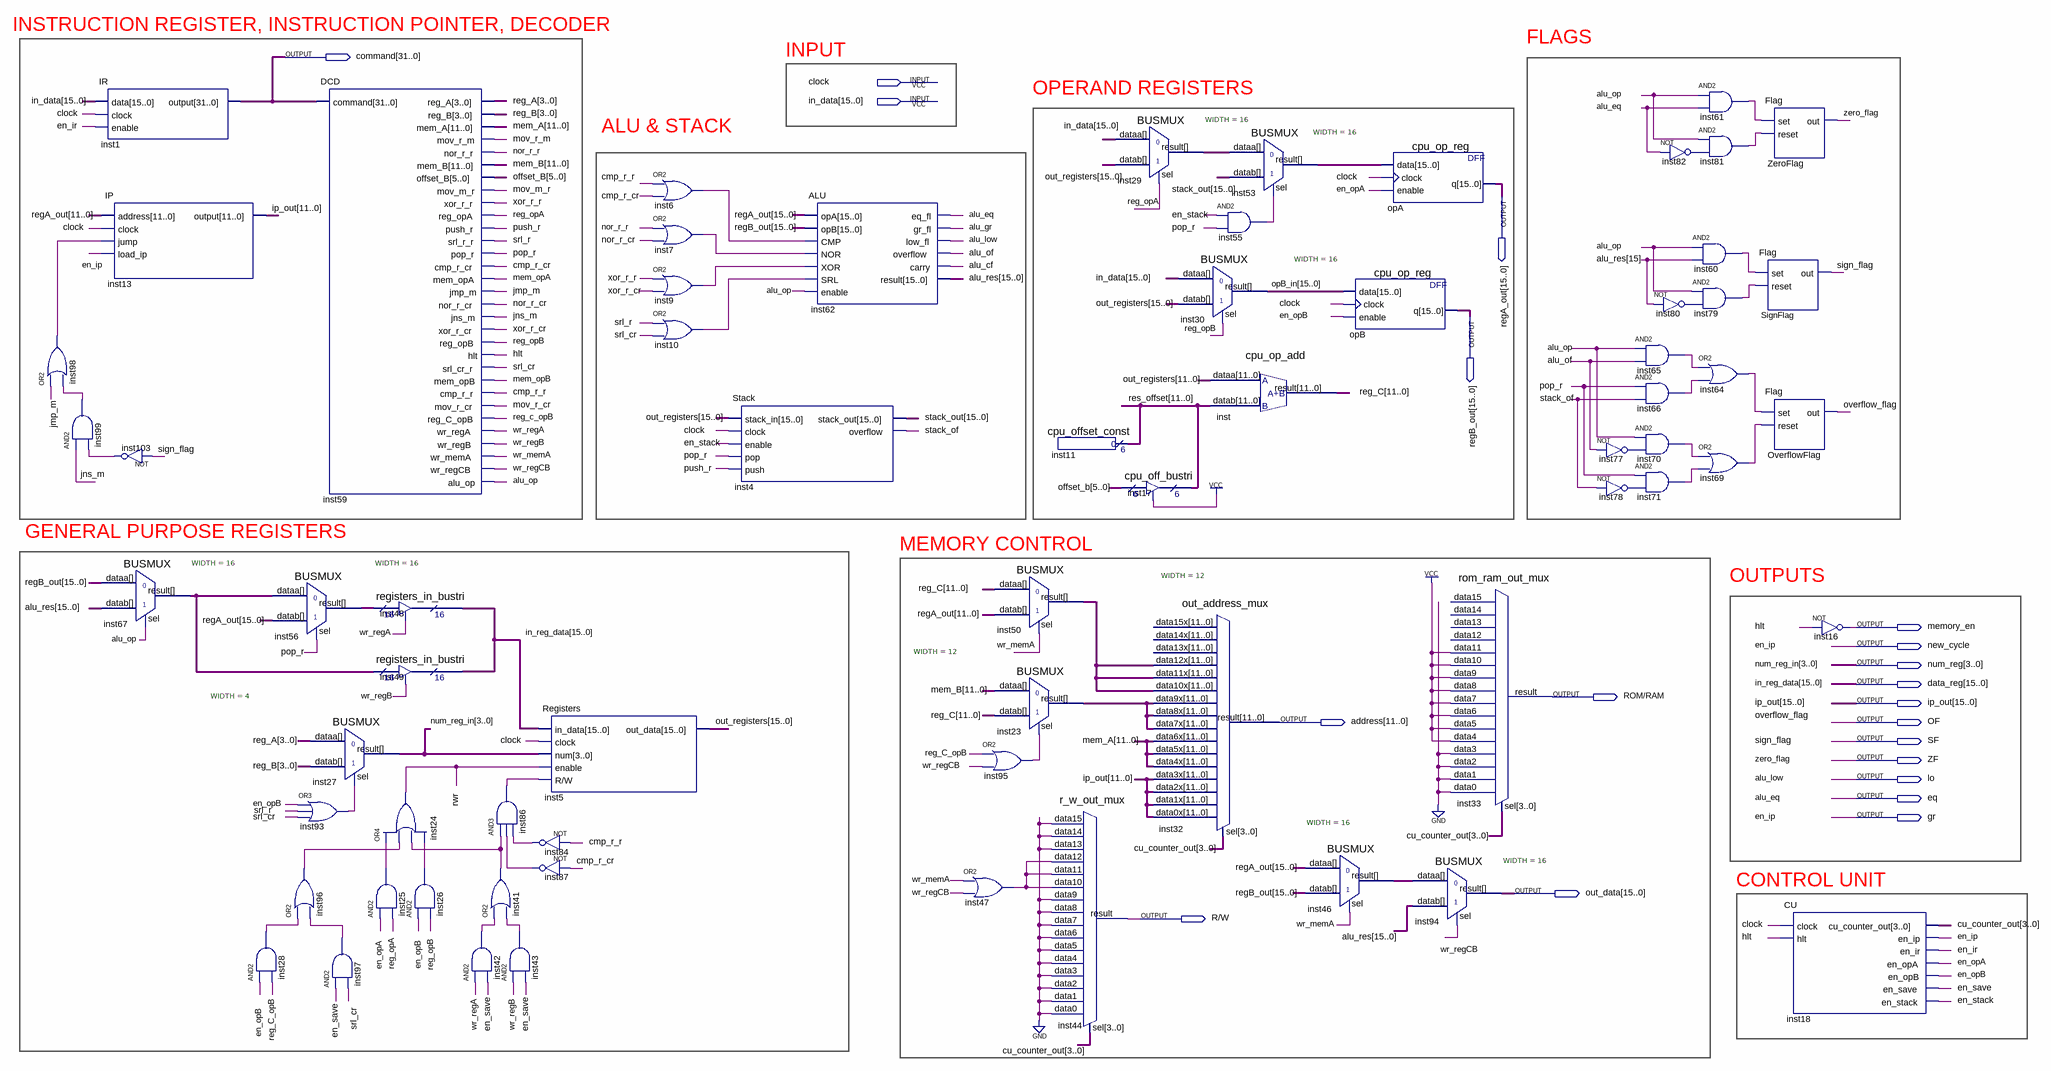
[diagram p0: schematic sheet]
// Quartus schematic CPU.bdf as structural Verilog: 68 symbols, 20 pins
module CPU (
  input  clock,
  input  [15:0] in_data,
  output [31:0] command,
  output [15:0] regA_out,
  output [15:0] regB_out,
  output memory_en,
  output new_cycle,
  output [3:0] num_reg,
  output [15:0] data_reg,
  output \ROM/RAM ,
  output [15:0] ip_out,
  output [11:0] address,
  output OF,
  output SF,
  output ZF,
  output lo,
  output eq,
  output gr,
  output [15:0] out_data,
  output \R/W 
);

  wire alu_cf, alu_gr, alu_of, alu_op, cmp_r_cr, cmp_r_r, en_ir, en_opA, en_opB, en_save, en_stack, hlt,
       inst6_out, inst7_out, inst9_out, inst10_out, inst25_out, inst26_out, inst28_out, inst41_out,
       inst42_out, inst43_out, inst47_out, inst55_out, inst60_out, inst61_out, inst64_out, inst65_out,
       inst66_out, inst69_out, inst70_out, inst71_out, inst77_out, inst78_out, inst79_out, inst80_out,
       inst81_out, inst82_out, inst84_out, inst86_out, inst87_out, inst93_out, inst95_out, inst96_out,
       inst97_out, inst98_out, inst99_out, inst103_out, jmp_m, jns_m, mem_opA, mem_opB, mov_m_r, mov_r_cr,
       mov_r_m, nor_r_cr, nor_r_r, pop_r, push_r, reg_C_opB, reg_opA, reg_opB, rwr, srl_cr, srl_r, stack_of,
       wr_memA, wr_regA, wr_regB, wr_regCB, xor_r_cr, xor_r_r;
  wire [3:0] cu_counter_out, reg_A, reg_B;
  wire [5:0] offset_B;
  wire [11:0] inst23_result, inst50_result, mem_A, mem_B, reg_C, res_offset;
  wire [15:0] alu_res, inst29_result, inst46_result, inst53_result, inst56_result, inst67_result, opB_in,
       out_registers, stack_out;

  or inst98 (inst98_out, jmp_m, inst99_out);
  IR inst1 (.data(in_data), .clock(clock), .enable(en_ir), .\output (command));
  IP inst13 (.address(regA_out[11:0]), .clock(clock), .jump(inst98_out), .load_ip(gr), .\output (ip_out[11:0]));
  and inst99 (inst99_out, jns_m, inst103_out);
  BUSMUX #(.WIDTH(16)) inst67 (.datab(alu_res), .sel(alu_op), .dataa(regB_out), .result(inst67_result));
  not inst103 (inst103_out, SF);
  and inst28 (inst28_out, en_opB, reg_C_opB);
  BUSMUX #(.WIDTH(16)) inst56 (.datab(regA_out), .sel(pop_r), .dataa(inst67_result), .result(inst56_result));
  BUSMUX #(.WIDTH(4)) inst27 (.datab(reg_B), .sel(inst93_out), .dataa(reg_A), .result(num_reg));
  or inst93 (inst93_out, en_opB, srl_r, srl_cr);
  or inst96 (inst96_out, inst28_out, inst97_out);
  DCD inst59 (
    .command(command), .reg_A(reg_A), .reg_B(reg_B), .mem_A(mem_A), .mov_r_m(mov_r_m), .nor_r_r(nor_r_r),
    .mem_B(mem_B), .offset_B(offset_B), .mov_m_r(mov_m_r), .xor_r_r(xor_r_r), .reg_opA(reg_opA),
    .push_r(push_r), .srl_r_r(srl_r), .pop_r(pop_r), .cmp_r_cr(cmp_r_cr), .mem_opA(mem_opA), .jmp_m(jmp_m),
    .nor_r_cr(nor_r_cr), .jns_m(jns_m), .xor_r_cr(xor_r_cr), .reg_opB(reg_opB), .hlt(hlt), .srl_cr_r(srl_cr),
    .mem_opB(mem_opB), .cmp_r_r(cmp_r_r), .mov_r_cr(mov_r_cr), .reg_C_opB(reg_C_opB), .wr_regA(wr_regA),
    .wr_regB(wr_regB), .wr_memA(wr_memA), .wr_regCB(wr_regCB), .alu_op(alu_op));
  and inst97 (inst97_out, en_save, srl_cr);
  registers_in_bustri inst48 (.enabledt(wr_regA), .data(inst56_result), .tridata(data_reg));
  registers_in_bustri inst49 (.enabledt(wr_regB), .data(inst67_result), .tridata(data_reg));
  or inst24 (rwr, inst25_out, inst96_out, inst41_out, inst26_out);
  and inst25 (inst25_out, en_opA, reg_opA);
  and inst26 (inst26_out, en_opB, reg_opB);
  and inst42 (inst42_out, wr_regA, en_save);
  and inst86 (inst86_out, inst41_out, inst87_out, inst84_out);
  or inst41 (inst41_out, inst42_out, inst43_out);
  and inst43 (inst43_out, wr_regB, en_save);
  Registers inst5 (
    .in_data(data_reg), .clock(clock), .num(num_reg), .enable(rwr), .\R/W (inst86_out),
    .out_data(out_registers));
  not inst84 (inst84_out, cmp_r_r);
  not inst87 (inst87_out, cmp_r_cr);
  or inst6 (inst6_out, cmp_r_r, cmp_r_cr);
  or inst7 (inst7_out, nor_r_r, nor_r_cr);
  or inst9 (inst9_out, xor_r_r, xor_r_cr);
  or inst10 (inst10_out, srl_r, srl_cr);
  Stack inst4 (
    .stack_in(out_registers), .clock(clock), .enable(en_stack), .pop(pop_r), .push(push_r),
    .stack_out(stack_out), .overflow(stack_of));
  ALU inst62 (
    .opA(regA_out), .opB(regB_out), .CMP(inst6_out), .NOR(inst7_out), .XOR(inst9_out), .SRL(inst10_out),
    .enable(alu_op), .eq_fl(eq), .gr_fl(alu_gr), .low_fl(lo), .overflow(alu_of), .carry(alu_cf),
    .result(alu_res));
  or inst47 (inst47_out, wr_memA, wr_regCB);
  BUSMUX #(.WIDTH(12)) inst50 (.datab(regA_out[11:0]), .sel(wr_memA), .dataa(reg_C), .result(inst50_result));
  BUSMUX #(.WIDTH(12)) inst23 (.datab(reg_C), .sel(inst95_out), .dataa(mem_B), .result(inst23_result));
  or inst95 (inst95_out, reg_C_opB, wr_regCB);
  cpu_offset_const inst11 (.result(res_offset[11:6]));
  r_w_out_mux inst44 (
    .data15(1'b0), .data14(1'b0), .data13(1'b0), .data12(inst47_out), .data11(inst47_out),
    .data10(inst47_out), .data9(1'b0), .data8(1'b0), .data7(1'b0), .data6(1'b0), .data5(1'b0), .data4(1'b0),
    .data3(1'b0), .data2(1'b0), .data1(1'b0), .data0(1'b0), .sel(cu_counter_out), .result(\R/W ));
  BUSMUX #(.WIDTH(16)) inst29 (.datab(out_registers), .sel(reg_opA), .dataa(in_data), .result(inst29_result));
  cpu_off_bustri inst17 (.enabledt(1'b1), .data(offset_B), .tridata(res_offset[5:0]));
  out_address_mux inst32 (
    .data12x(inst50_result), .data11x(inst50_result), .data10x(inst50_result), .data9x(inst23_result),
    .data8x(inst23_result), .data7x(inst23_result), .data6x(mem_A), .data5x(mem_A), .data4x(mem_A),
    .data3x(ip_out[11:0]), .data2x(ip_out[11:0]), .data1x(ip_out[11:0]), .data0x(ip_out[11:0]),
    .sel(cu_counter_out), .result(address));  // open: data15x, data14x, data13x
  and inst55 (inst55_out, en_stack, pop_r);
  BUSMUX #(.WIDTH(16)) inst30 (.datab(out_registers), .sel(reg_opB), .dataa(in_data), .result(opB_in));
  cpu_op_add inst (.dataa(out_registers[11:0]), .datab(res_offset), .result(reg_C));
  BUSMUX #(.WIDTH(16)) inst53 (.datab(stack_out), .sel(inst55_out), .dataa(inst29_result), .result(inst53_result));
  BUSMUX #(.WIDTH(16)) inst46 (.datab(regB_out), .sel(wr_memA), .dataa(regA_out), .result(inst46_result));
  cpu_op_reg opB (.data(opB_in), .clock(clock), .enable(en_opB), .q(regB_out));
  cpu_op_reg opA (.data(inst53_result), .clock(clock), .enable(en_opA), .q(regA_out));
  BUSMUX #(.WIDTH(16)) inst94 (.datab(alu_res), .sel(wr_regCB), .dataa(inst46_result), .result(out_data));
  rom_ram_out_mux inst33 (
    .data11(1'b1), .data10(1'b1), .data9(1'b1), .data8(1'b1), .data7(1'b1), .data6(1'b1), .data5(1'b1),
    .data4(1'b1), .data3(1'b0), .data2(1'b0), .data1(1'b0), .data0(1'b0), .sel(cu_counter_out),
    .result(\ROM/RAM ));  // open: data15, data14, data13, data12
  not inst77 (inst77_out, alu_of);
  not inst78 (inst78_out, stack_of);
  not inst82 (inst82_out, eq);
  not inst80 (inst80_out, alu_res[15]);
  and inst65 (inst65_out, alu_op, alu_of);
  and inst66 (inst66_out, pop_r, stack_of);
  and inst70 (inst70_out, alu_op, inst77_out);
  and inst71 (inst71_out, pop_r, inst78_out);
  and inst61 (inst61_out, alu_op, eq);
  and inst81 (inst81_out, alu_op, inst82_out);
  and inst60 (inst60_out, alu_op, alu_res[15]);
  and inst79 (inst79_out, alu_op, inst80_out);
  or inst64 (inst64_out, inst65_out, inst66_out);
  or inst69 (inst69_out, inst70_out, inst71_out);
  Flag ZeroFlag (.set(inst61_out), .reset(inst81_out), .out(ZF));
  Flag SignFlag (.set(inst60_out), .reset(inst79_out), .out(SF));
  Flag OverflowFlag (.set(inst64_out), .reset(inst69_out), .out(OF));
  CU inst18 (
    .clock(clock), .hlt(hlt), .cu_counter_out(cu_counter_out), .en_ip(gr), .en_ir(en_ir), .en_opA(en_opA),
    .en_opB(en_opB), .en_save(en_save), .en_stack(en_stack));
  not inst16 (memory_en, hlt);

  assign new_cycle = gr;

  // Other names for the same wires on the sheet: alu_eq = eq; alu_low = lo; en_ip = gr; in_reg_data[15:0] = data_reg;
  //   num_reg_in[3:0] = num_reg; overflow_flag = OF; sign_flag = SF; zero_flag = ZF

  // Notes on the sheet:
  //   INSTRUCTION REGISTER, INSTRUCTION POINTER, DECODER
  //   FLAGS
  //   INPUT
  //   OPERAND REGISTERS
  //   ALU & STACK
  //   GENERAL PURPOSE REGISTERS
  //   MEMORY CONTROL
  //   OUTPUTS
  //   CONTROL UNIT
endmodule
